# EAGLE design drill-rev-1 (EAGLE 6.5.0)
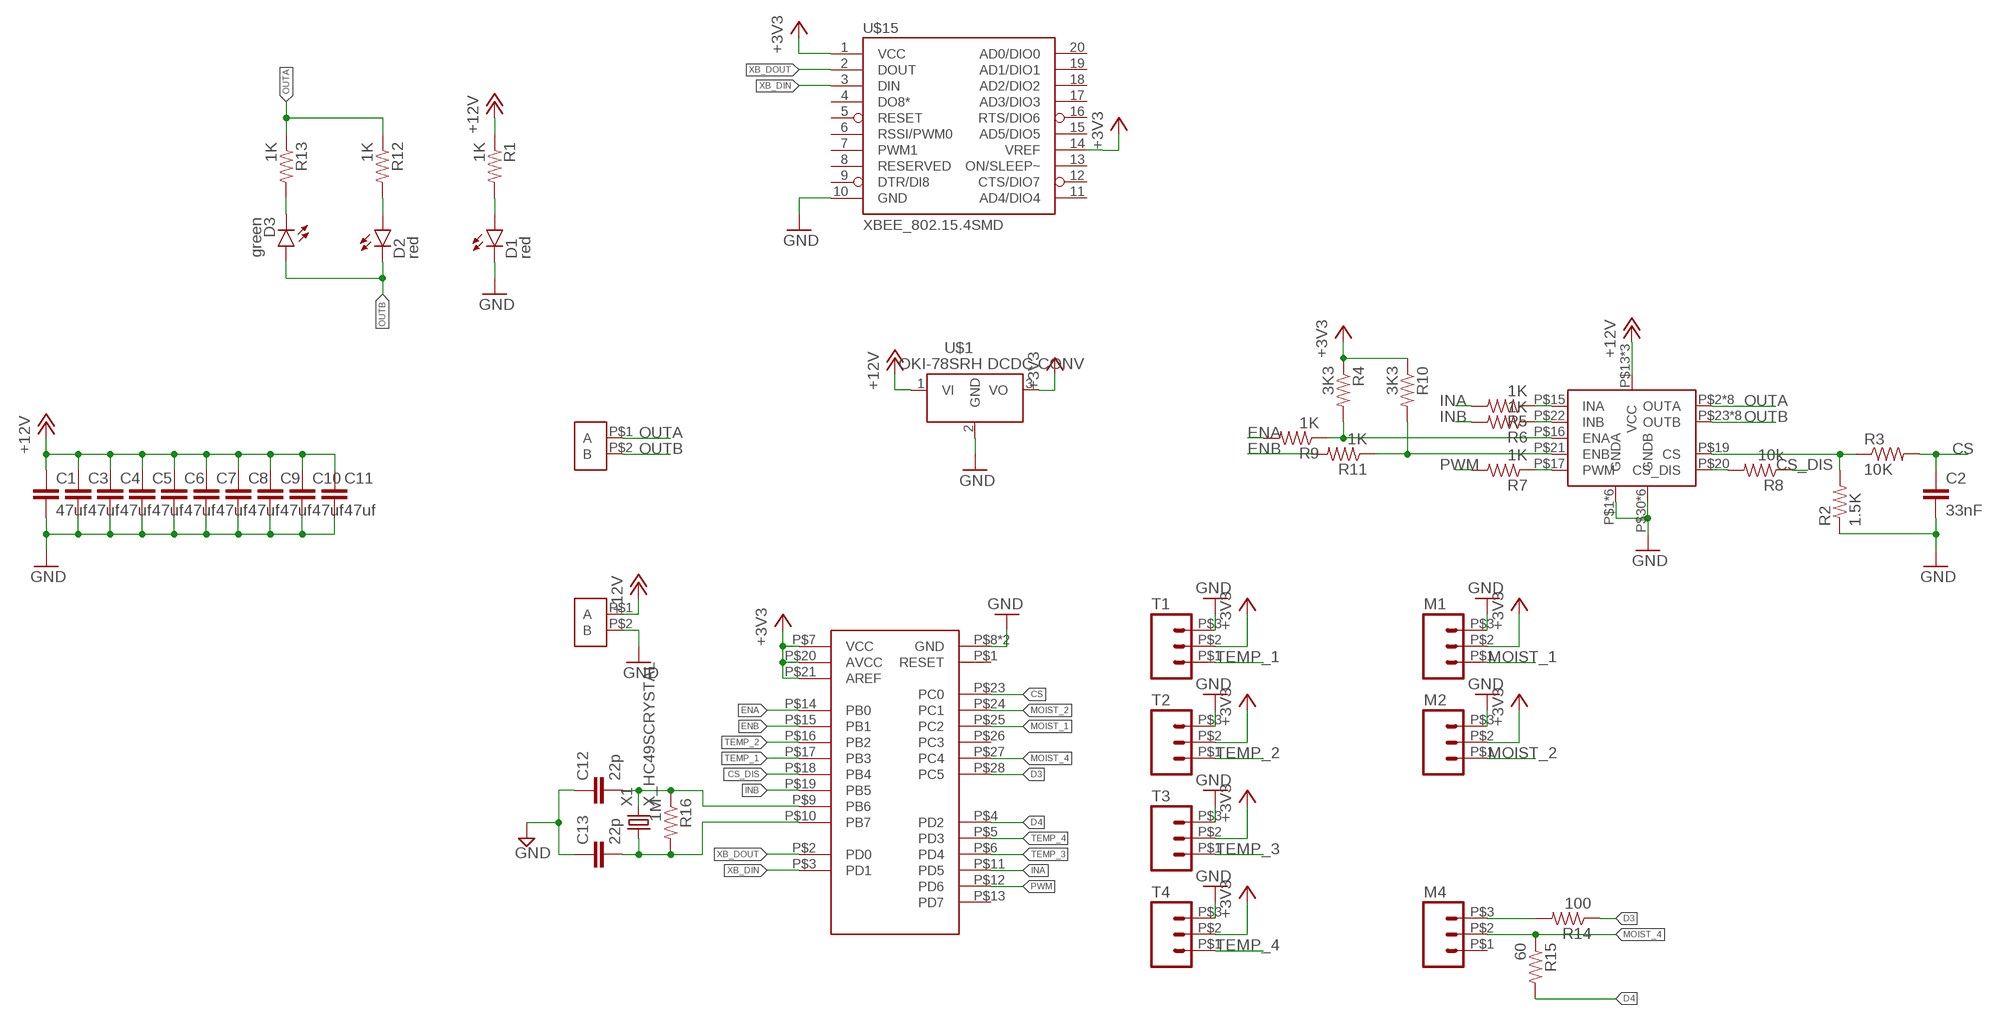
[diagram p0: schematic, sheet 1]

## Parts
C1  47uf  CAP1210  [1210]
C2  33nF  CAP0603-CAP  [0603-CAP]
C3  47uf  CAP1210  [1210]
C4  47uf  CAP1210  [1210]
C5  47uf  CAP1210  [1210]
C6  47uf  CAP1210  [1210]
C7  47uf  CAP1210  [1210]
C8  47uf  CAP1210  [1210]
C9  47uf  CAP1210  [1210]
C10  47uf  CAP1210  [1210]
C11  47uf  CAP1210  [1210]
C12  22p  CAP0603-CAP  [0603-CAP]
C13  22p  CAP0603-CAP  [0603-CAP]
D1  red  LED0603  [LED-0603]
D2  red  LED0603  [LED-0603]
D3  green  LED0603  [LED-0603]
M1  M03VERT  [MOLEX0436500328]
M2  M03VERT  [MOLEX0436500328]
M4  M03VERT  [MOLEX0436500328]
R1  1K  RESISTOR0603  [0603-RES]
R2  1.5K  RESISTOR0603  [0603-RES]
R3  10K  RESISTOR0603  [0603-RES]
R4  3K3  RESISTOR0603  [0603-RES]
R5  1K  RESISTOR0603  [0603-RES]
R6  1K  RESISTOR0603  [0603-RES]
R7  1K  RESISTOR0603  [0603-RES]
R8  10k  RESISTOR0603  [0603-RES]
R9  1K  RESISTOR0603  [0603-RES]
R10  3K3  RESISTOR0603  [0603-RES]
R11  1K  RESISTOR0603  [0603-RES]
R12  1K  RESISTOR0603  [0603-RES]
R13  1K  RESISTOR0603  [0603-RES]
R14  100  RESISTOR1206  [1206]
R15  60  RESISTOR1206  [1206]
R16  1M  RESISTOR0603  [0603-RES]
T1  M03VERT  [MOLEX0436500328]
T2  M03VERT  [MOLEX0436500328]
T3  M03VERT  [MOLEX0436500328]
T4  M03VERT  [MOLEX0436500328]
U$1  Q_OKI-78SR  [OKI-78SR_HORIZ]
U$3  TE_2POS-5MM_SCREW_TERM  [TE_2POS-5MM_SCREW_TERM]
U$5  TE_2POS-5MM_SCREW_TERM  [TE_2POS-5MM_SCREW_TERM]
U$6  VNH5XXX_HBRIDGEVNH5050A  [POWERSSO-36_TP]
U$13  DIP_SKT_ATMEGA  [DIP_SKT_ATMEGA]
U$15  XBEE_802.15.4SMD  [XBEE_802.15.4_SMD]
X1  X_HC49SCRYSTAL  [HC-49]

## Nets
+3V3: M1.P$2 M2.P$2 R4.1 R10.1 T1.P$2 T2.P$2 T3.P$2 T4.P$2 U$1.3(VO) U$13.P$7(VCC) U$13.P$20(AVCC) U$13.P$21(AREF) U$15.1(VCC) U$15.14(VREF)
+12V: C1.1 C3.1 C4.1 C5.1 C6.1 C7.1 C8.1 C9.1 C10.1 C11.1 R1.1 U$1.1(VI) U$5.P$1(A) U$6.P$13(VCC) U$6.P$24(VCC) U$6.SLUG1(VCC)
CS: C2.1 R3.2 U$13.P$23(PC0)
CS_DIS: R8.1 U$13.P$18(PB4)
D3: R14.1 U$13.P$28(PC5)
D4: R15.2 U$13.P$4(PD2)
ENA: R9.2 U$13.P$14(PB0)
ENB: R11.2 U$13.P$15(PB1)
GND: C1.2 C2.2 C3.2 C4.2 C5.2 C6.2 C7.2 C8.2 C9.2 C10.2 C11.2 C12.1 C13.1 D1.C M1.P$3 M2.P$3 R2.1 T1.P$3 T2.P$3 T3.P$3 T4.P$3 U$1.2(GND) U$5.P$2(B) U$6.P$1(GNDA) U$6.P$3(GNDA) U$6.P$4(GNDA) U$6.P$5(GNDA) U$6.P$6(GNDA) U$6.P$7(GNDA) U$6.P$30(GNDB) U$6.P$31(GNDB) U$6.P$32(GNDB) U$6.P$33(GNDB) U$6.P$34(GNDB) U$6.P$36(GNDB) U$13.P$8(GND) U$13.P$22(GND) U$15.10(GND)
INA: R5.2 U$13.P$11(PD5)
INB: R6.2 U$13.P$19(PB5)
MOIST_1: M1.P$1 U$13.P$25(PC2)
MOIST_2: M2.P$1 U$13.P$24(PC1)
MOIST_4: M4.P$2 R15.1 U$13.P$27(PC4)
N$1: M4.P$3 R14.2
N$2: R4.2 R9.1 U$6.P$16(ENA)
N$3: R2.2 R3.1 U$6.P$19(CS)
N$4: D1.A R1.2
N$5: D2.A R12.2
N$7: R10.2 R11.1 U$6.P$21(ENB)
N$8: R5.1 U$6.P$15(INA)
N$9: R6.1 U$6.P$22(INB)
N$10: R7.1 U$6.P$17(PWM)
N$11: R8.2 U$6.P$20(CS_DIS)
N$12: D3.C R13.2
OUTA: R12.1 R13.1 U$3.P$1(A) U$6.P$2(OUTA) U$6.P$8(OUTA) U$6.P$9(OUTA) U$6.P$10(OUTA) U$6.P$11(OUTA) U$6.P$12(OUTA) U$6.P$14(OUTA) U$6.SLUG2(OUTA)
OUTB: D2.C D3.A U$3.P$2(B) U$6.P$23(OUTB) U$6.P$25(OUTB) U$6.P$26(OUTB) U$6.P$27(OUTB) U$6.P$28(OUTB) U$6.P$29(OUTB) U$6.P$35(OUTB) U$6.SLUG3(OUTB)
PWM: R7.2 U$13.P$12(PD6)
TEMP_1: T1.P$1 U$13.P$17(PB3)
TEMP_2: T2.P$1 U$13.P$16(PB2)
TEMP_3: T3.P$1 U$13.P$6(PD4)
TEMP_4: T4.P$1 U$13.P$5(PD3)
XB_DIN: U$13.P$3(PD1) U$15.3(DIN)
XB_DOUT: U$13.P$2(PD0) U$15.2(DOUT)
XTAL1: C12.2 R16.1 U$13.P$9(PB6) X1.P$2
XTAL2: C13.2 R16.2 U$13.P$10(PB7) X1.P$1
Unconnected: M4.P$1 U$13.P$1(RESET) U$13.P$13(PD7) U$13.P$26(PC3) U$15.4(DO8*) U$15.5(RESET) U$15.6(RSSI/PWM0) U$15.7(PWM1) U$15.8(RESERVED) U$15.9(DTR/DI8) U$15.11(AD4/DIO4) U$15.12(CTS/DIO7) U$15.13(ON/SLEEP~) U$15.15(AD5/DIO5) U$15.16(RTS/DIO6) U$15.17(AD3/DIO3) U$15.18(AD2/DIO2) U$15.19(AD1/DIO1) U$15.20(AD0/DIO0)

## Library data of the parts
C1-C13 = SparkFun-Passives:CAP: Capacitor Standard 0603 ceramic capacitor, and 0.1" leaded capacitor.
D1-D3 = SparkFun-LED:LED: LEDs Standard schematic elements and footprints for 5mm, 3mm, 1206, and 0603 sized LEDs. 5mm - Spark Fun Electronics SKU : COM-00529 (and others)
M1 M2 M4 T1-T4 = MRDT-Connectors:M03
R1-R16 = SparkFun-Resistors:RESISTOR: Resistor Basic schematic elements and footprints for 0603, 1206, and PTH resistors.
U$1 = MRDT-2015-PowerBoard:Q_OKI-78SR: 4.95W DC/DC Converter Manufacturer: Murata Part Number: OKI-78SR-5/1.5-W36H-C OKI-78SR-3.3/1.5-W36H-C
U$3 U$5 = MRDT-Connectors:TE_2POS-5MM_SCREW_TERM
U$6 = MRDT-PowerICs:VNH5XXX_HBRIDGE
U$13 = MRDT-Connectors:DIP_SKT_ATMEGA
U$15 = MRDT-RF:XBEE_802.15.4
X1 = MRDT-2014-All:X_HC49SCRYSTAL: CRYSTAL METAL CAN, 16MHZ, 18PF, HC-49/US

## Board
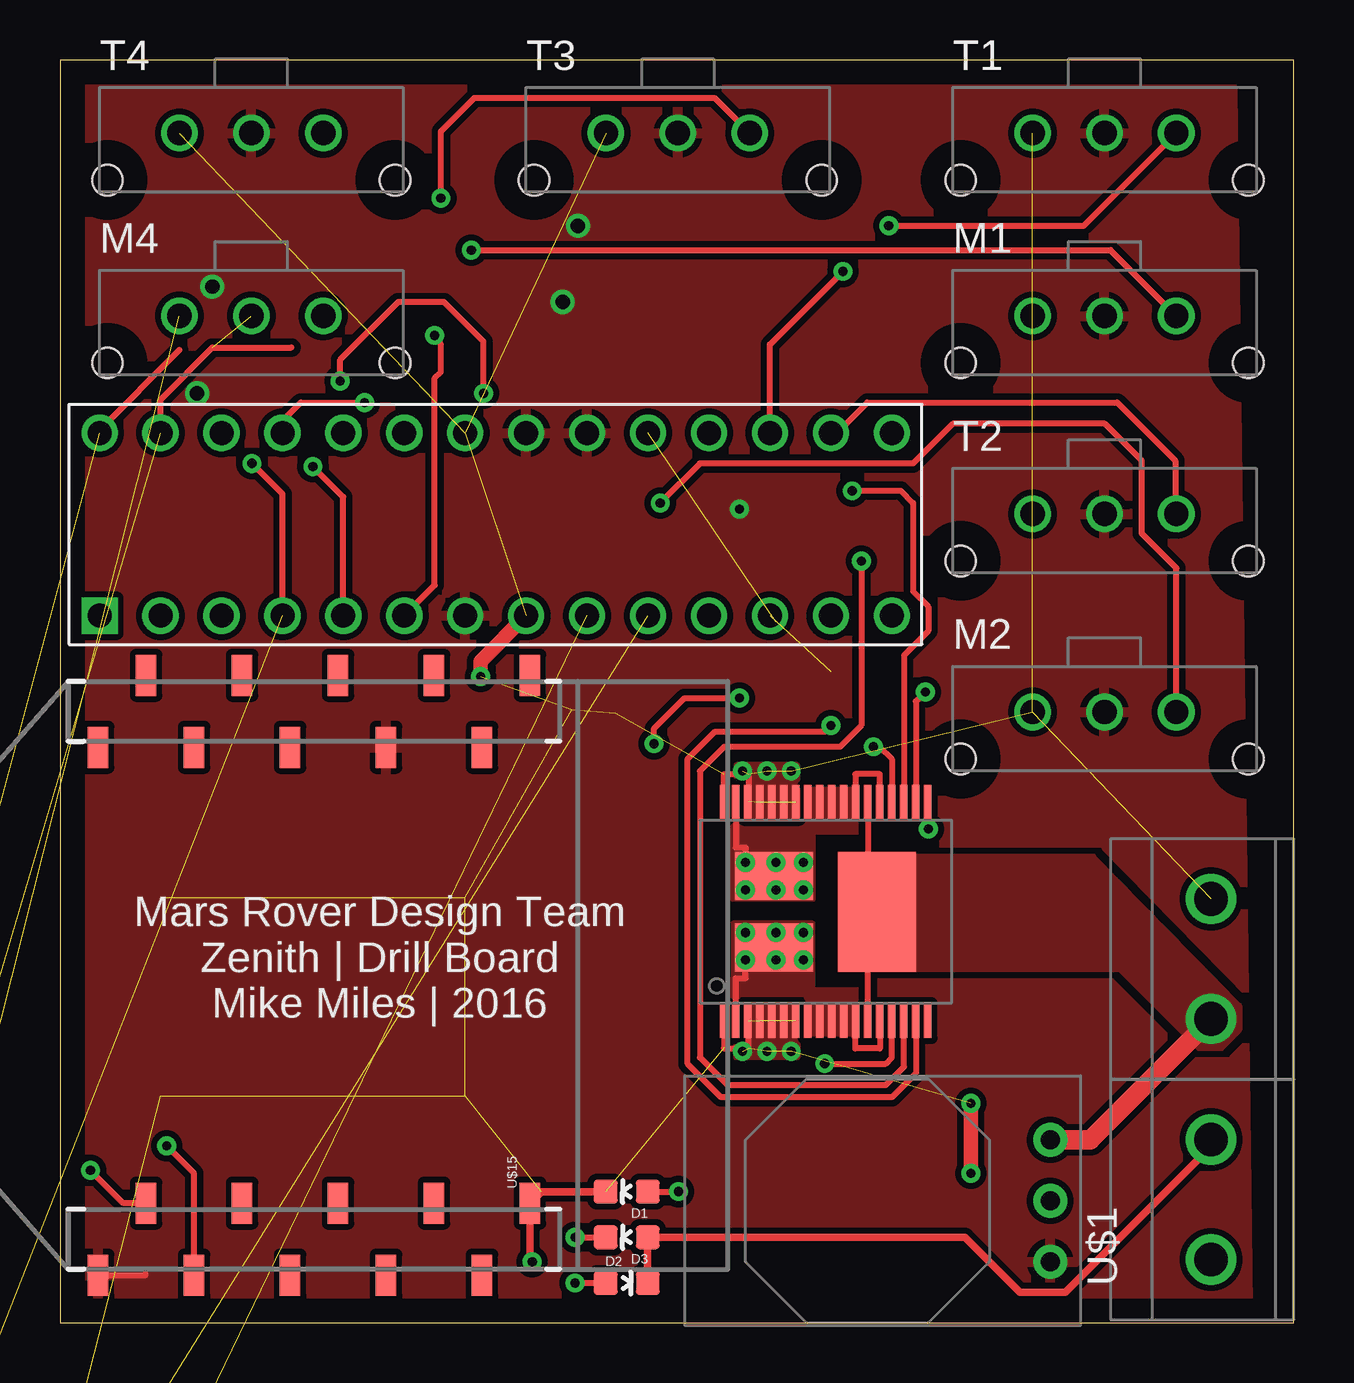
[diagram p1: board, top side]
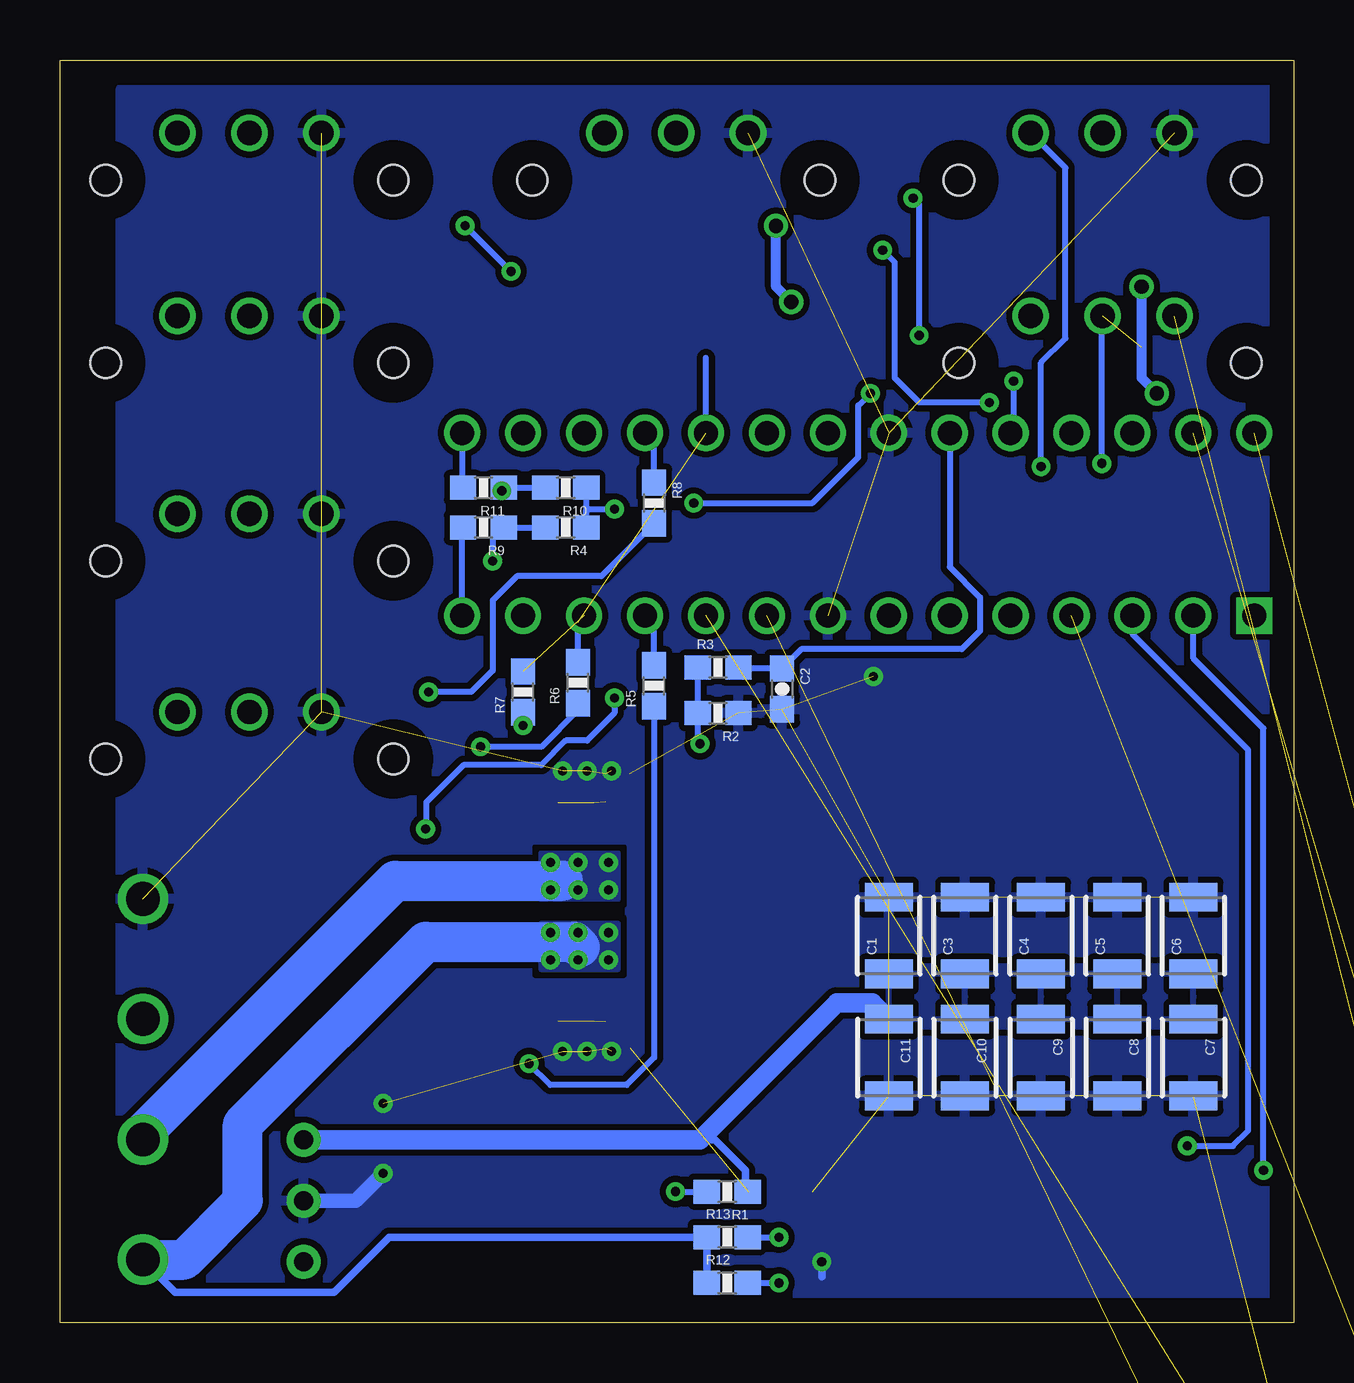
[diagram p2: board, bottom side, seen from below]

Size 51.44 x 52.63 mm. Coordinates in mm from the lower left corner, seen from the top.
Outline: 0,0 51.44,0 51.44,52.63 0,52.63 0,0
Copper layers (1*16): Top 0.035mm / dielectric 1.5mm / Bottom 0.035mm
Design rules "default *": minimum track width 6mil, minimum drill 10mil, track to track 5mil, track to pad 5mil, pad to pad 5mil, via to via 5mil, smd to smd 5mil, copper to edge 40mil, drill to drill 8mil, minimum pad ring 10mil, minimum via ring 8mil, stop-mask expansion 4mil, vias tented up to drill 0mil, thermal gap 10mil

### Footprints (pad centres in the part's own frame; a part is rotated, then mirrored left to right if it is on the bottom)
1210 = smd 1.2 x 2: 1 -1.6,0; 2 1.6,0
0603-CAP = smd 1.1 x 1: 1 -0.85,0; 2 0.85,0
LED-0603 = smd 1 x 1: A 0,-0.877; C 0,0.877
MOLEX0436500328 = drill 1.016: P$1 9.322,2.464; P$2 6.325,2.464; P$3 3.327,2.464 | hole 1.27: 0.33,0.508; 12.319,0.508
0603-RES = smd 1.1 x 1: 1 -0.85,0; 2 0.85,0
1206 = smd 1.6 x 1.8: 1 -1.4,0; 2 1.4,0
OKI-78SR_HORIZ = drill 0.8 pad 1.422: 1 0,0; 2 -2.54,0; 3 -5.08,0
TE_2POS-5MM_SCREW_TERM = drill 1.4: P$1 2.5,3.45; P$2 7.5,3.45
POWERSSO-36_TP = smd 0.322 x 1.45: P$1 1,-0.75; P$2 1.5,-0.75; P$3 2,-0.75; P$4 2.5,-0.75; P$5 3,-0.75; P$6 3.5,-0.75; P$7 4,-0.75; P$8 4.5,-0.75; P$9 5,-0.75; P$10 5.5,-0.75; P$11 6,-0.75; P$12 6.5,-0.75; P$13 7,-0.75; P$14 7.5,-0.75; P$15 8,-0.75; P$16 8.5,-0.75; P$17 9,-0.75; P$18 9.5,-0.75; P$19 9.5,8.35; P$20 9,8.35; P$21 8.5,8.35; P$22 8,8.35; P$23 7.5,8.35; P$24 7,8.35; P$25 6.5,8.35; P$26 6,8.35; P$27 5.5,8.35; P$28 5,8.35; P$29 4.5,8.35; P$30 4,8.35; P$31 3.5,8.35; P$32 3,8.35; P$33 2.5,8.35; P$34 2,8.35; P$35 1.5,8.35; P$36 1,8.35 | smd 3.25 x 5: SLUG1 7.391,3.785 | smd 3.25 x 2: SLUG2 3.099,2.311; SLUG3 3.099,5.283
DIP_SKT_ATMEGA = drill 1 square: P$1 0,0 | drill 1: P$2 0,-2.54; P$3 0,-5.08; P$4 0,-7.62; P$5 0,-10.16; P$6 0,-12.7; P$7 0,-15.24; P$8 0,-17.78; P$9 0,-20.32; P$10 0,-22.86; P$11 0,-25.4; P$12 0,-27.94; P$13 0,-30.48; P$14 0,-33.02; P$15 7.62,-33.02; P$16 7.62,-30.48; P$17 7.62,-27.94; P$18 7.62,-25.4; P$19 7.62,-22.86; P$20 7.62,-20.32; P$21 7.62,-17.78; P$22 7.62,-15.24; P$23 7.62,-12.7; P$24 7.62,-10.16; P$25 7.62,-7.62; P$26 7.62,-5.08; P$27 7.62,-2.54; P$28 7.62,0
XBEE_802.15.4_SMD = smd 1.7 x 0.85: 1 -13.77,20; 2 -10.77,18; 3 -13.77,16; 4 -10.77,14; 5 -13.77,12; 6 -10.77,10; 7 -13.77,8; 8 -10.77,6; 9 -13.77,4; 10 -10.77,2; 11 11.23,2; 12 8.23,4; 13 11.23,6; 14 8.23,8; 15 11.23,10; 16 8.23,12; 17 11.23,14; 18 8.23,16; 19 11.23,18; 20 8.23,20
HC-49 = drill 0.5 square: P$1 3.235,2.325; P$2 8.115,2.325

### Placement (x,y rotation side)
C1  16.89,16.13 90 bottom
C2  21.34,26.42 270 bottom
C3  13.72,16.13 90 bottom
C4  10.54,16.13 90 bottom
C5  7.37,16.13 90 bottom
C6  4.19,16.13 90 bottom
C7  4.19,11.05 270 bottom
C8  7.37,11.05 270 bottom
C9  10.54,11.05 270 bottom
C10  13.72,11.05 270 bottom
C11  16.89,11.05 270 bottom
C12  -8,-29.34 0 top  (outside the outline)
C13  -4.95,-29.34 0 top  (outside the outline)
D1  23.62,5.46 90 top
D2  23.62,1.65 270 top
D3  23.62,3.56 90 top
M1  37.21,39.5 0 top
M2  37.21,22.99 0 top
M4  1.65,39.5 0 top
R1  23.62,5.46 180 bottom
R2  24,25.4 180 bottom
R3  24,27.3 0 bottom
R4  30.35,33.15 180 bottom
R5  26.67,26.54 90 bottom
R6  29.84,26.67 90 bottom
R7  32.13,26.29 90 bottom
R8  26.67,34.16 270 bottom
R9  33.78,33.15 180 bottom
R10  30.35,34.8 180 bottom
R11  33.78,34.8 180 bottom
R12  23.62,1.65 0 bottom
R13  23.62,3.56 0 bottom
R14  -10.41,-13.21 0 top  (outside the outline)
R15  -10.41,-17.02 0 top  (outside the outline)
R16  -11.18,-29.34 0 top  (outside the outline)
T1  37.21,47.12 0 top
T2  37.21,31.24 0 top
T3  19.43,47.12 0 top
T4  1.65,47.12 0 top
U$1  41.27,7.62 90 top
U$3  51.44,0.13 90 top
U$5  51.44,10.16 90 top
U$6  26.67,13.34 0 top
U$13  1.65,29.46 90 top
U$15  21.59,15.75 90 top
X1  -11.81,-25.91 0 top  (outside the outline)

### Tracks (layer width: path | path; a pad name or v marks a point on that pad's centre or on a via)
+3V3  (via drill 0.38, 0.6)
  Top 0.254: U$15.1 3.56,1.98 3.56,2.03
  Bottom 0.254: R10.1 R4.1 29.5,33.87 29.46,33.91 v28.32,33.91
  Bottom 0.406: v5.71,38.73 6.35,39.37 v6.35,43.18 | v20.95,42.55 21.59,43.18 v21.59,45.72
  pour Top (isolate 0.254, rank 6): 0.64,51.44 1.27,0.64 49.53,0.64 48.9,51.44
+12V
  Top 0.254: U$6.P$24 33.67,19.07 33.66,19.05 | U$6.P$13 33.67,15.22 | 33.67,15.22 33.66,15.24 | 33.67,15.22 33.67,16.73 U$6.SLUG1
  Top 0.813: U$5.P$1 42.95,7.62 U$1.1
  Bottom 0.305: 24.77,7.62 24.13,7.62 22.86,6.35 22.86,5.55 R1.1
  Bottom 0.813: C11.1 17.58,13.34 19.05,13.34 24.77,7.62 U$1.1
  pour Bottom: 3.56,12.32 17.53,12.32 17.53,14.86 3.56,14.86
  pour Top (no thermals): 33.66,19.43 43.05,19.43 49.15,13.21 49.15,12.19 48.39,11.43 47.5,11.43 44.2,14.73 35.31,14.73 33.66,16.38
CS
  Bottom 0.254: U$13.P$23 14.35,31.5 13.08,30.23 13.08,28.83 13.84,28.07 20.54,28.07 C2.1 23.11,27.27 R3.2
CS_DIS
  Bottom 0.254: R8.1 26.67,36.7 U$13.P$18
D3  (1 unrouted)
  Top 0.254: 4.98,40.54 1.65,37.21 U$13.P$28
D4  (via drill 0.38)  (1 unrouted)
  Top 0.254: U$13.P$4 9.27,34.54 v8,35.81
  Bottom 0.254: v8,35.81 8,41.94
ENA
  Bottom 0.254: U$13.P$14 34.67,33.11 R9.2
ENB
  Bottom 0.254: U$13.P$15 34.67,34.84 R11.2
GND  (via drill 0.38)  (40 unrouted)
  Top 0.254: U$6.P$1 27.67,11.45 27.69,11.43 28.7,11.43 28.7,12.55 U$6.P$3 | U$6.P$36 27.67,22.84 27.69,22.86 28.7,22.86 28.7,21.72 U$6.P$34
  Top 0.305: D1.C 20.07,5.46 U$15.10 19.59,2.63 v19.68,2.54
  Top 0.61: v17.53,26.92 17.53,27.56 U$13.P$8 | v37.97,6.22 v37.97,9.14
  Bottom 0.305: v19.68,2.54 19.68,1.91
  Bottom 0.61: U$1.2 39.12,5.08 v37.97,6.22
  other vias: 28.45,11.3 29.46,11.3 30.48,11.3 28.45,22.99 29.46,22.99 30.48,22.99
  pour Bottom (isolate 0.254, rank 6): 0.64,51.44 0.64,0.64 48.9,0.64 48.9,51.44
  pour Top (isolate 0.254, no thermals): 30.73,13.21 30.73,11.05 28.19,11.05 28.19,11.56 28.7,11.56 28.7,13.21
  pour Top (no thermals): 30.73,22.23 30.73,21.08 28.7,21.08 28.7,22.23
  pour Top (isolate 0.254, no thermals): 30.73,21.08 30.73,23.24 28.19,23.24 28.19,22.73 28.7,22.73 28.7,21.08
INA
  Bottom 0.254: R5.2 26.67,29.08 U$13.P$11
INB  (1 unrouted)
  Bottom 0.254: R6.2 29.84,29.21 | U$13.P$19 24.51,40.21
MOIST_1  (via drill 0.38)
  Top 0.254: U$13.P$25 9.27,37.59 10.03,38.35 v12.7,38.35 | v17.14,44.7 43.79,44.7 M1.P$1
  Bottom 0.254: v12.7,38.35 15.62,38.35 16.64,39.37 16.64,44.2 v17.14,44.7
MOIST_2  (via drill 0.38)
  Top 0.254: M2.P$1 46.53,31.45 45.09,32.89 45.09,35.94 43.56,37.47 37.21,37.47 35.56,35.81 26.67,35.81 v25.02,34.16 | v17.65,38.73 17.65,40.89 16,42.55 14.1,42.55 11.68,40.13 v11.68,39.24
  Bottom 0.254: v25.02,34.16 20.07,34.16 18.16,36.07 18.16,38.23 v17.65,38.73 | U$13.P$24 11.68,37.21 v11.68,39.24
MOIST_4  (2 unrouted)
  Top 0.254: U$13.P$27 4.19,38.48 6.35,40.64 9.65,40.64
N$1  (1 unrouted)
N$2  (via drill 0.38)
  Top 0.254: v33.4,31.75 33.4,24.89 32.51,24 27.69,24 26.67,22.99 26.67,11.05 27.81,9.91 34.42,9.91 35.18,10.67 35.18,12.58 U$6.P$16
  Bottom 0.254: R4.2 R9.1 33.4,32.68 v33.4,31.75
N$3  (via drill 0.38)
  Top 0.254: v24.77,24.13 24.77,24.77 26.04,26.04 v28.32,26.04 | v36.2,20.57 36.2,21.66 U$6.P$19
  Bottom 0.254: R3.1 R2.2 24.85,24.22 v24.77,24.13 | v28.32,26.04 28.32,25.4 29.46,24.26 30.35,24.26 31.37,23.24 34.61,23.24 U$6.P$19 36.17,20.6 v36.2,20.57
N$4  (via drill 0.38)
  Top 0.254: D1.A v25.78,5.46
  Bottom 0.254: v25.78,5.46 R1.2
N$5  (via drill 0.38)
  Top 0.254: v21.46,1.65 D2.A
  Bottom 0.254: R12.2 v21.46,1.65
N$7  (via drill 0.38)
  Top 0.254: U$6.P$21 35.18,27.81 36.2,28.83 36.2,29.84 35.56,30.48 35.56,34.16 35.05,34.67 v33.02,34.67
  Bottom 0.254: R10.2 R11.1 33.02,34.71 v33.02,34.67
N$8  (via drill 0.38)
  Top 0.254: v31.88,10.79 34.42,10.79 34.67,11.05 U$6.P$15
  Bottom 0.254: R5.1 26.67,11.05 27.81,9.91 30.99,9.91 v31.88,10.79
N$9  (via drill 0.38)
  Top 0.254: v33.91,24 34.16,24 34.67,23.5 U$6.P$22
  Bottom 0.254: R6.1 29.84,25.53 31.37,24 v33.91,24
N$10  (via drill 0.38)
  Top 0.254: U$6.P$17 35.67,10.4 34.67,9.4 27.56,9.4 26.16,10.79 26.16,23.5 27.3,24.64 31.88,24.64 v32.13,24.89
  Bottom 0.254: v32.13,24.89 R7.1
N$11  (via drill 0.38)
  Top 0.254: v36.07,26.29 35.67,25.89 U$6.P$20
  Bottom 0.254: R8.2 28.87,31.11 32.38,31.11 33.4,30.1 33.4,27.18 34.29,26.29 v36.07,26.29
N$12  (via drill 0.38)
  Top 0.254: v21.46,3.56 D3.C
  Bottom 0.254: R13.2 v21.46,3.56
OUTA  (via drill 0.38)
  Top 0.254: U$6.P$14 34.17,11.44 34.16,11.43 33.15,11.43 33.15,12.56 U$6.P$12 | U$6.P$2 28.17,14.35 28.57,14.35 v28.57,15.11
  Bottom 0.305: R12.1 R13.1 37.72,3.56 40.01,1.27 46.63,1.27 U$3.P$1
  Bottom 1.676: U$3.P$1 46.27,2.63 43.81,5.08 43.81,8.26 36.2,15.88 30,15.88 U$6.SLUG2
  other vias: 30.99,16.26 30.99,15.11 29.84,15.11 29.84,16.26 28.57,16.26
  pour Top (isolate 0.254, rank 2, no thermals): 34.16,12.06 34.16,13.84 31.37,13.84 31.37,16.64 28.07,16.64 28.07,12.06
  pour Bottom: 28.19,16.64 28.19,14.73 31.37,14.73 31.37,16.64
OUTB  (via drill 0.38)
  Top 0.254: U$6.P$23 34.17,22.73 34.16,22.86 33.15,22.86 33.15,21.71 U$6.P$25 | U$6.P$35 28.17,19.8 28.57,19.8 v28.57,19.18
  Top 0.305: D2.C D3.A 37.72,3.56 40.01,1.27 41.91,1.27 47.98,7.34 U$3.P$2
  Bottom 1.676: U$3.P$2 47.98,7.89 37.47,18.41 30.48,18.41
  other vias: 30.99,19.18 30.99,18.03 29.84,18.03 29.84,19.18 28.57,18.03
  pour Top (isolate 0.254, no thermals): 34.16,22.23 34.16,20.45 31.37,20.45 31.37,17.65 28.07,17.65 28.07,22.23
  pour Bottom: 28.19,19.56 28.19,17.65 31.37,17.65 31.37,19.56
PWM  (1 unrouted)
TEMP_1  (via drill 0.38)
  Top 0.254: U$13.P$17 29.59,40.77 v32.64,43.81 | v34.54,45.72 42.67,45.72 T1.P$1
  Bottom 0.254: v32.64,43.81 v34.54,45.72
TEMP_2
  Top 0.254: U$13.P$16 32.38,37.08 33.66,38.35 44.07,38.35 46.48,35.94 46.48,33.76 T2.P$1
TEMP_3  (via drill 0.38)
  Top 0.254: U$13.P$6 15.62,30.73 15.62,39.37 15.88,39.62 15.88,40.77 v15.62,41.15 | v15.88,46.86 15.88,49.66 17.27,51.05 27.28,51.05 T3.P$1
  Bottom 0.254: v15.62,41.15 15.62,46.61 v15.88,46.86
TEMP_4  (via drill 0.38)
  Top 0.254: U$13.P$5 11.81,34.42 v10.54,35.69
  Bottom 0.254: v10.54,35.69 10.54,40.01 9.53,41.02 9.53,48.13 T4.P$1
XB_DIN  (via drill 0.38)
  Top 0.254: U$15.3 5.59,6.22 v4.45,7.37
  Bottom 0.254: v4.45,7.37 2.54,7.37 1.91,8 1.91,23.88 6.73,28.7 U$13.P$3
XB_DOUT  (via drill 0.38)
  Top 0.254: U$15.2 2.64,4.98 v1.27,6.35
  Bottom 0.254: v1.27,6.35 1.27,24.77 4.19,27.69 U$13.P$2
XTAL1  (3 unrouted)
XTAL2  (3 unrouted)

### Text on the board
tPlace: Mars Rover Design Team / Zenith | Drill Board / Mike Miles | 2016
_tNames: Mars Rover Design Team / Zenith | Drill Board / Mike Miles | 2016